# EAGLE design unicorder-temp-mk-1.0 (EAGLE 6.5.0)
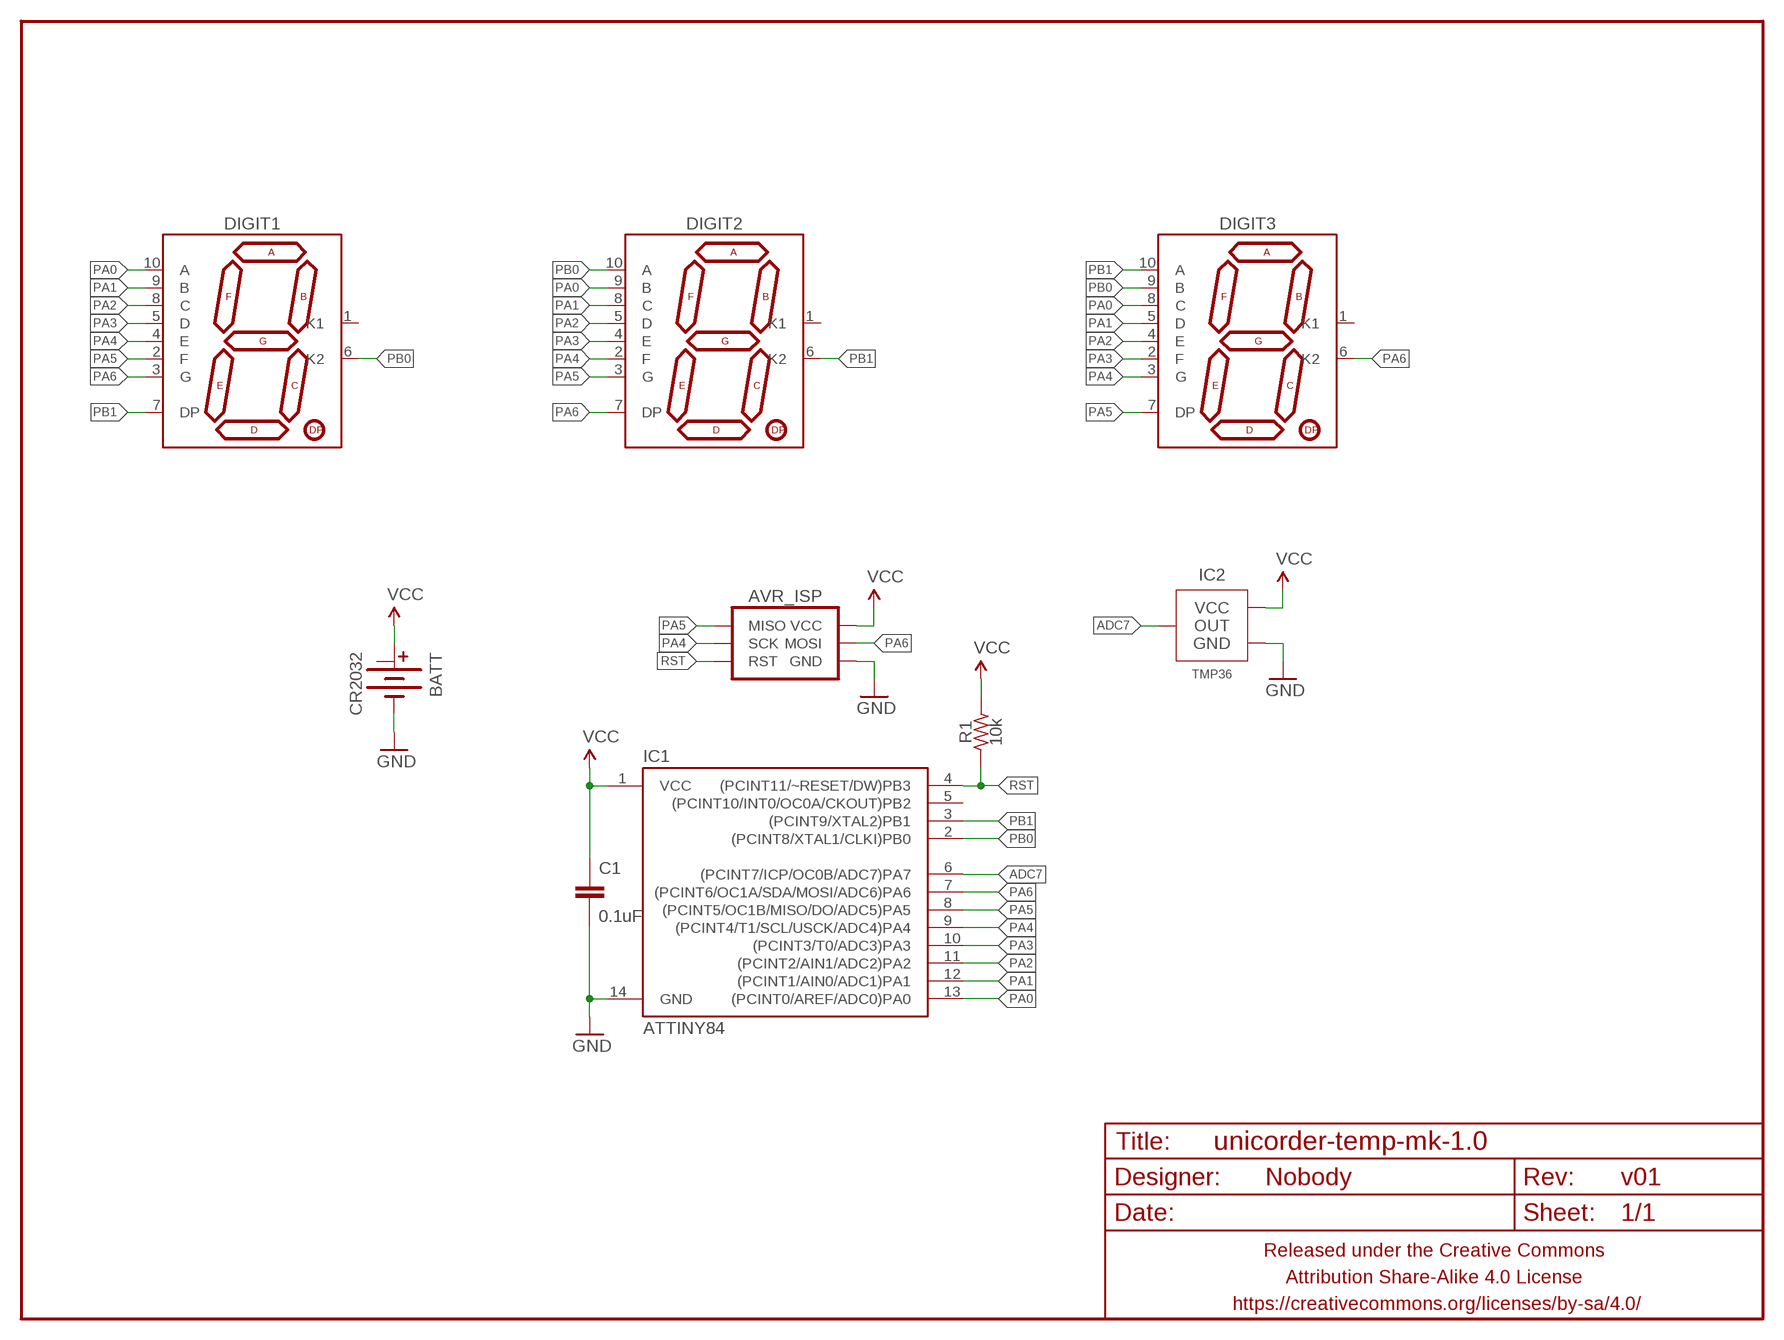
[diagram p0: schematic, sheet 1]

## Parts
AVR_ISP  AVR_SPI_PRG_6PTH  [2X3]
BATT  CR2032  BATTERY-COINCR2032_SMD  [BATTCON_20MM_MINE]
C1  0.1uF  CAPACITOR-CERAMIC025-024X044  [C025-024X044]
DIGIT1  7SEG_1DIGPTH-10MM  [7SEG_1DIG_10MM]
DIGIT2  7SEG_1DIGPTH-10MM  [7SEG_1DIG_10MM]
DIGIT3  7SEG_1DIGPTH-10MM  [7SEG_1DIG_10MM]
FRAME1  FRAME-LETTERNO_PACKAGE  [DUMMY]
IC1  ATTINY84  ATTINY84ATTINY84-20PU  [DIL14]
IC2  TMP36  TMP36TO-92  [TO-92-AMMO]
R1  10k  RESISTORPTH-AXIAL-7.62MM  [RESISTOR-AXIAL-PTH-7.62MM]

## Nets
ADC7: IC1.6((PCINT7/ICP/OC0B/ADC7)PA7) IC2.2(OUT)
GND: AVR_ISP.6(GND) BATT.BOTTOM(-) C1.2 IC1.14(GND) IC2.3(GND)
PA0: DIGIT1.10(A) DIGIT2.9(B) DIGIT3.8(C) IC1.13((PCINT0/AREF/ADC0)PA0)
PA1: DIGIT1.9(B) DIGIT2.8(C) DIGIT3.5(D) IC1.12((PCINT1/AIN0/ADC1)PA1)
PA2: DIGIT1.8(C) DIGIT2.5(D) DIGIT3.4(E) IC1.11((PCINT2/AIN1/ADC2)PA2)
PA3: DIGIT1.5(D) DIGIT2.4(E) DIGIT3.2(F) IC1.10((PCINT3/T0/ADC3)PA3)
PA4: AVR_ISP.3(SCK) DIGIT1.4(E) DIGIT2.2(F) DIGIT3.3(G) IC1.9((PCINT4/T1/SCL/USCK/ADC4)PA4)
PA5: AVR_ISP.1(MISO) DIGIT1.2(F) DIGIT2.3(G) DIGIT3.7(DP) IC1.8((PCINT5/OC1B/MISO/DO/ADC5)PA5)
PA6: AVR_ISP.4(MOSI) DIGIT1.3(G) DIGIT2.7(DP) DIGIT3.6(K2) IC1.7((PCINT6/OC1A/SDA/MOSI/ADC6)PA6)
PB0: DIGIT1.6(K2) DIGIT2.10(A) DIGIT3.9(B) IC1.2((PCINT8/XTAL1/CLKI)PB0)
PB1: DIGIT1.7(DP) DIGIT2.6(K2) DIGIT3.10(A) IC1.3((PCINT9/XTAL2)PB1)
RST: AVR_ISP.5(RST) IC1.4((PCINT11/~RESET/DW)PB3) R1.P$1
VCC: AVR_ISP.2(VCC) BATT.TOP@1(+) C1.1 IC1.1(VCC) IC2.1(VCC) R1.P$2
Unconnected: BATT.TOP@2(+1) DIGIT1.1(K1) DIGIT2.1(K1) DIGIT3.1(K1) IC1.5((PCINT10/INT0/OC0A/CKOUT)PB2)

## Library data of the parts
AVR_ISP = A_butts:AVR_SPI_PRG_6: AVR ISP 6 Pin This is the reduced ISP connector for AVR programming. Common on Arduino. This footprint will take up less PCB space and can be used with a 10-pin to 6-pin adapter such as SKU: BOB-08508 **Special note about "TEST_POINT" package. The stop mask is on the top side, so if you want your programming test points to be on the bottom of your board, make sure to place this package on the bottom side of the board. This also ensure that the orientation to program from the bottom side will be correct.
BATT = A_butts:BATTERY-COIN
C1 = A_butts:CAPACITOR-CERAMIC: CAPACITOR, European symbol
DIGIT1-DIGIT3 = A_butts:7SEG_1DIG
FRAME1 = A_butts:FRAME-LETTER: Schematic Frame Standard 8.5x11 US Letter frame; DESIGNER: Nobody; VERSION: v01
IC1 = A_butts:ATTINY84: Atmel 14-pin 2/4/8kB flash uC
IC2 = A_butts:TMP36
R1 = A_butts:RESISTOR: RESISTOR, American symbol

## Board
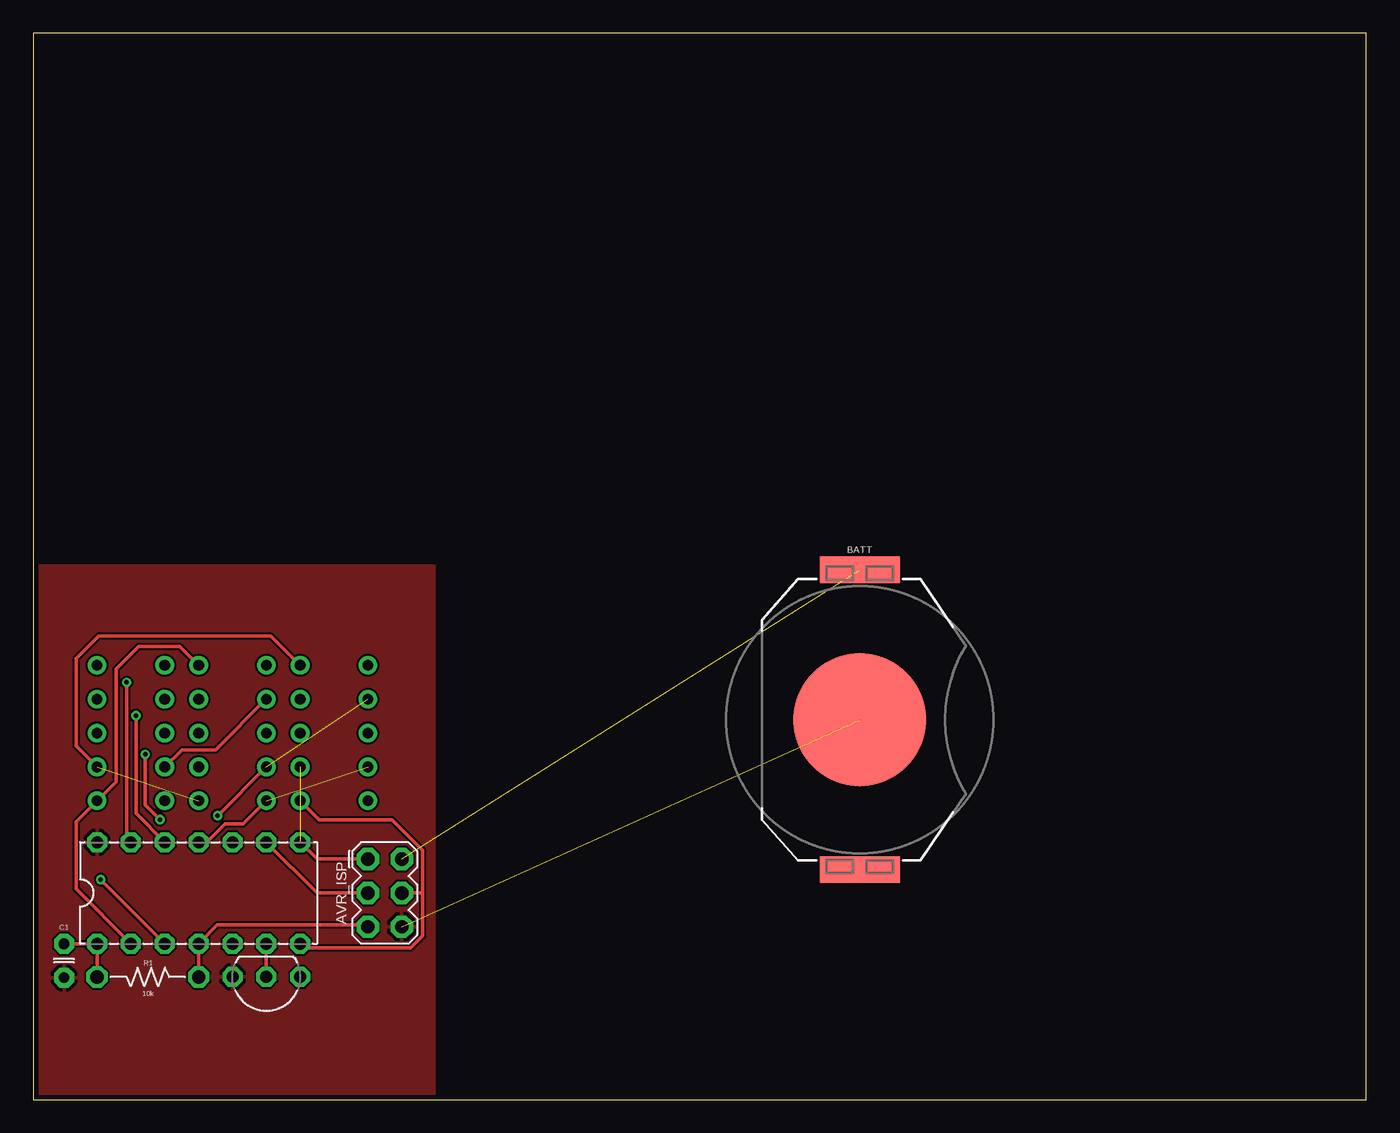
[diagram p1: board, top side]
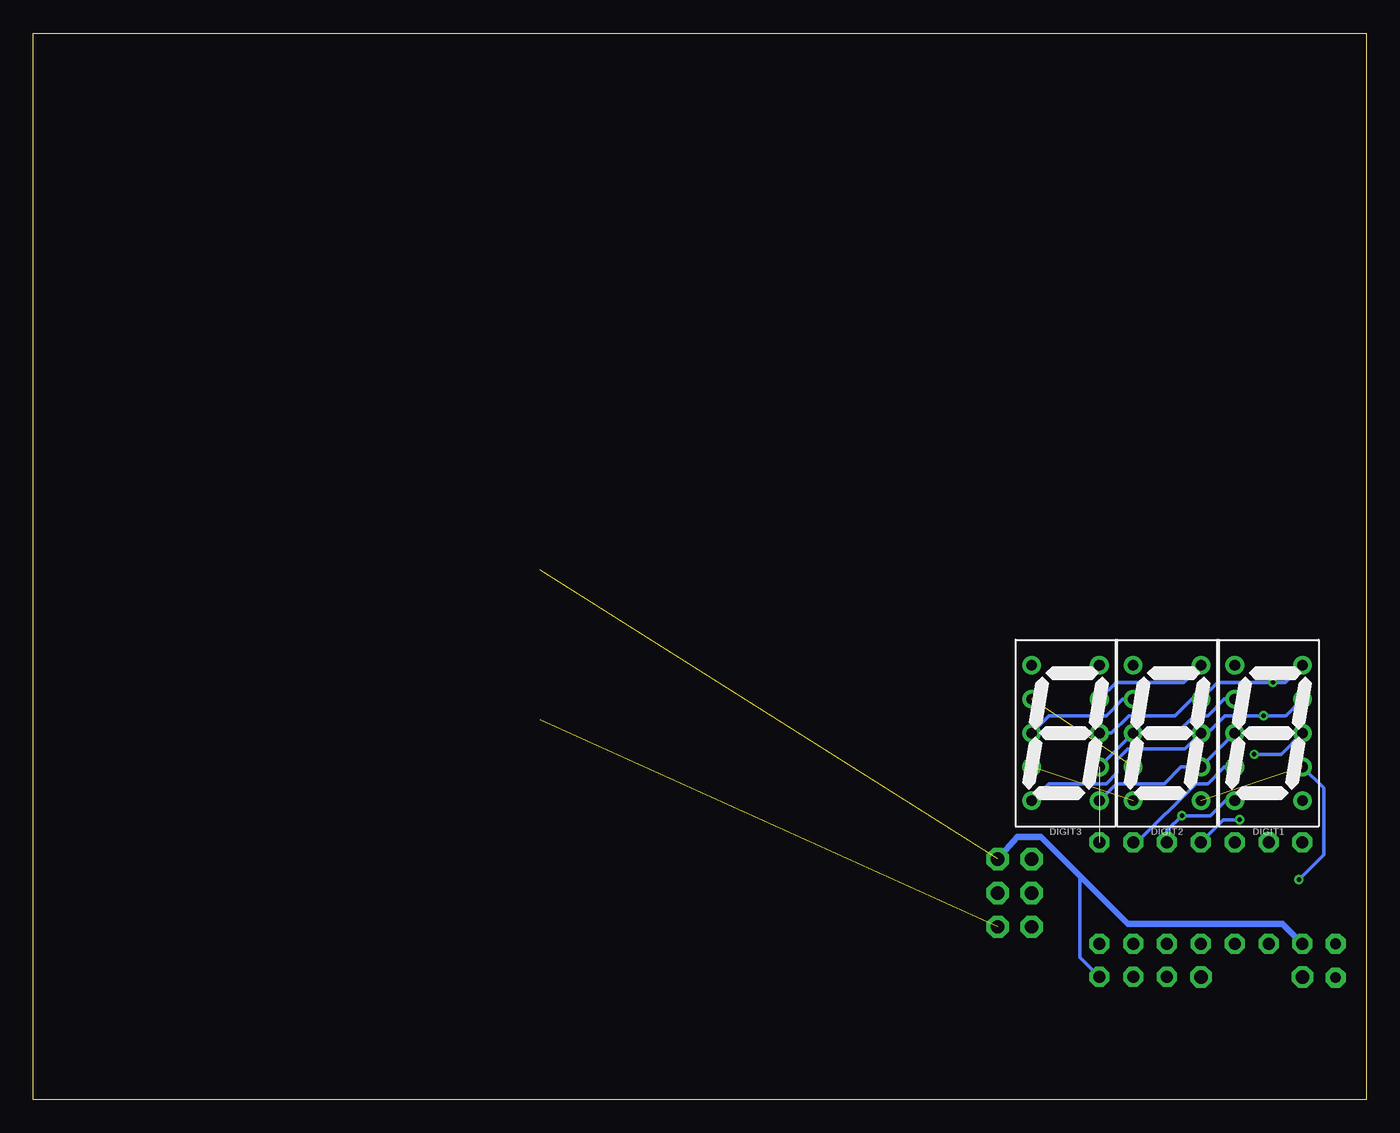
[diagram p2: board, bottom side, seen from below]

Size 100 x 80 mm. Coordinates in mm from the lower left corner, seen from the top.
Outline: 0,0 100,0 100,80 0,80 0,0
Copper layers (1*16): Top 0.0356mm / dielectric 1.5011mm / Bottom 0.0356mm
Design rules "LaenPCBOrder_2": minimum track width 6mil, minimum drill 13mil, track to track 6mil, track to pad 6mil, pad to pad 6mil, via to via 6mil, smd to smd 6mil, copper to edge 15mil, drill to drill 6mil, minimum pad ring 7mil, minimum via ring 7mil, stop-mask expansion 3mil, vias tented up to drill 20mil, thermal gap 10mil

### Footprints (pad centres in the part's own frame; a part is rotated, then mirrored left to right if it is on the bottom)
2X3 = drill 1 pad 1.676 octagon: 1 -2.54,-1.27; 2 -2.54,1.27; 3 0,-1.27; 4 0,1.27; 5 2.54,-1.27; 6 2.54,1.27
BATTCON_20MM_MINE = smd 10 x 10: BOTTOM 0,0 | smd 6 x 2: TOP@1 0,11.25; TOP@2 0,-11.25
C025-024X044 = drill 0.813 pad 1.5 octagon: 1 -1.27,0; 2 1.27,0
7SEG_1DIG_10MM = drill 0.8 pad 1.4: 1 -2.54,5.08; 2 -2.54,2.54; 3 -2.54,0; 4 -2.54,-2.54; 5 -2.54,-5.08; 6 2.54,-5.08; 7 2.54,-2.54; 8 2.54,0; 9 2.54,2.54; 10 2.54,5.08
DIL14 = drill 0.9 pad 1.5 octagon: 1 -7.62,-3.81; 2 -5.08,-3.81; 3 -2.54,-3.81; 4 0,-3.81; 5 2.54,-3.81; 6 5.08,-3.81; 7 7.62,-3.81; 8 7.62,3.81; 9 5.08,3.81; 10 2.54,3.81; 11 0,3.81; 12 -2.54,3.81; 13 -5.08,3.81; 14 -7.62,3.81
TO-92-AMMO = drill 0.9 pad 1.5 octagon: 1 -2.54,0; 2 0,0; 3 2.54,0
RESISTOR-AXIAL-PTH-7.62MM = drill 1 pad 1.6 octagon: P$1 -3.81,0; P$2 3.81,0

### Placement (x,y rotation side)
AVR_ISP  26.37,15.5 270 top
BATT  62,28.5 0 top
C1  2.3,10.42 270 top
DIGIT1  7.32,27.5 0 bottom
DIGIT2  14.94,27.5 0 bottom
DIGIT3  22.56,27.5 0 bottom
FRAME1  0,0 0 top
IC1  12.4,15.5 0 top
IC2  17.48,9.2 180 top
R1  8.59,9.2 180 top

### Tracks (layer width: path | path; a pad name or v marks a point on that pad's centre or on a via)
ADC7
  Top 0.25: IC2.2 IC1.6
GND  (1 unrouted)
  pour Top: -0.1,-0.1 -0.1,40.1 30.1,40.1 30.1,-0.1
PA0  (via drill 0.33)
  Top 0.25: IC1.13 7,19.63 v7,31.3
  Bottom 0.25: DIGIT3.8 19.12,27.5 17.82,28.8 14.34,28.8 13.1,30.04 DIGIT2.9 11.14,31.3 v7,31.3 6.06,31.3 DIGIT1.10
PA1  (via drill 0.33)
  Top 0.25: v7.7,28.8 7.7,21.47 IC1.12
  Bottom 0.25: DIGIT1.9 6.02,28.8 v7.7,28.8 10.6,28.8 11.9,27.5 DIGIT2.8 13.6,26.3 17.9,26.3 18.7,25.5 18.7,24.5 19.5,23.7 23.82,23.7 DIGIT3.5
PA2  (via drill 0.33)  (1 unrouted)
  Top 0.25: v9.5,21 8.4,22.1 v8.4,25.9 | IC1.11 13.01,19.31 14.4,20.7 15.76,20.7 DIGIT2.5
  Bottom 0.25: IC1.11 10.71,21 v9.5,21 | v8.4,25.9 6.38,25.9 DIGIT1.8
PA3  (via drill 0.33)  (1 unrouted)
  Top 0.25: v13.82,21.3 DIGIT2.4
  Bottom 0.25: DIGIT1.5 10.58,22.42 11.7,21.3 v13.82,21.3 14.94,20.18 IC1.10
PA4
  Top 0.25: AVR_ISP.3 21.29,15.5 IC1.9 | DIGIT1.4 11.15,26.25 13.69,26.25 DIGIT2.2
  Bottom 0.25: DIGIT2.2 18.26,30.04 19.5,28.8 23.8,28.8 DIGIT3.3 | IC1.9 17.19,19.31 12.8,23.7 11.9,23.7 10.64,24.96 DIGIT1.4
PA5  (1 unrouted)
  Top 0.25: AVR_ISP.1 21.29,18.04 IC1.8
  Bottom 0.25: DIGIT3.7 DIGIT2.3 14.2,27.5 12.9,28.8 11.9,28.8 10.66,30.04 DIGIT1.2
PA6
  Top 0.25: IC1.7 20.31,11.4 28.3,11.4 29.2,12.3 29.2,15.5 | 29.2,15.5 29.2,18.7 26.9,21 21.44,21 DIGIT3.6 | AVR_ISP.4 29.2,15.5
  Bottom 0.25: DIGIT3.6 18.74,23.7 15.16,23.7 13.9,24.96 DIGIT2.7 DIGIT1.3
PB0
  Top 0.25: IC1.2 3.2,15.81 3.2,20.84 DIGIT1.6 6.2,23.84 6.2,32.3 7.9,34 10.98,34 DIGIT2.10
  Bottom 0.25: DIGIT2.10 13.68,31.3 18.76,31.3 DIGIT3.9
PB1  (via drill 0.33)  (1 unrouted)
  Top 0.25: IC1.3 v5.05,16.5 | DIGIT1.7 3.2,26.54 3.2,33.1 4.9,34.8 17.8,34.8 DIGIT3.10
  Bottom 0.25: v5.05,16.5 3.2,18.35 3.2,23.38 DIGIT1.7
RST
  Top 0.25: R1.P$1 IC1.4 13.81,13.1 24.96,13.1 AVR_ISP.5
VCC  (1 unrouted)
  Top 0.25: C1.1 IC1.1 R1.P$2
  Bottom 0.25: IC2.1 21.5,10.68 21.5,16.8
  Bottom 0.5: AVR_ISP.2 26.18,19.7 24.4,19.7 21.5,16.8 17.9,13.2 6.29,13.2 IC1.1